# Altium project TIMESTICK_2.1.PrjPcb
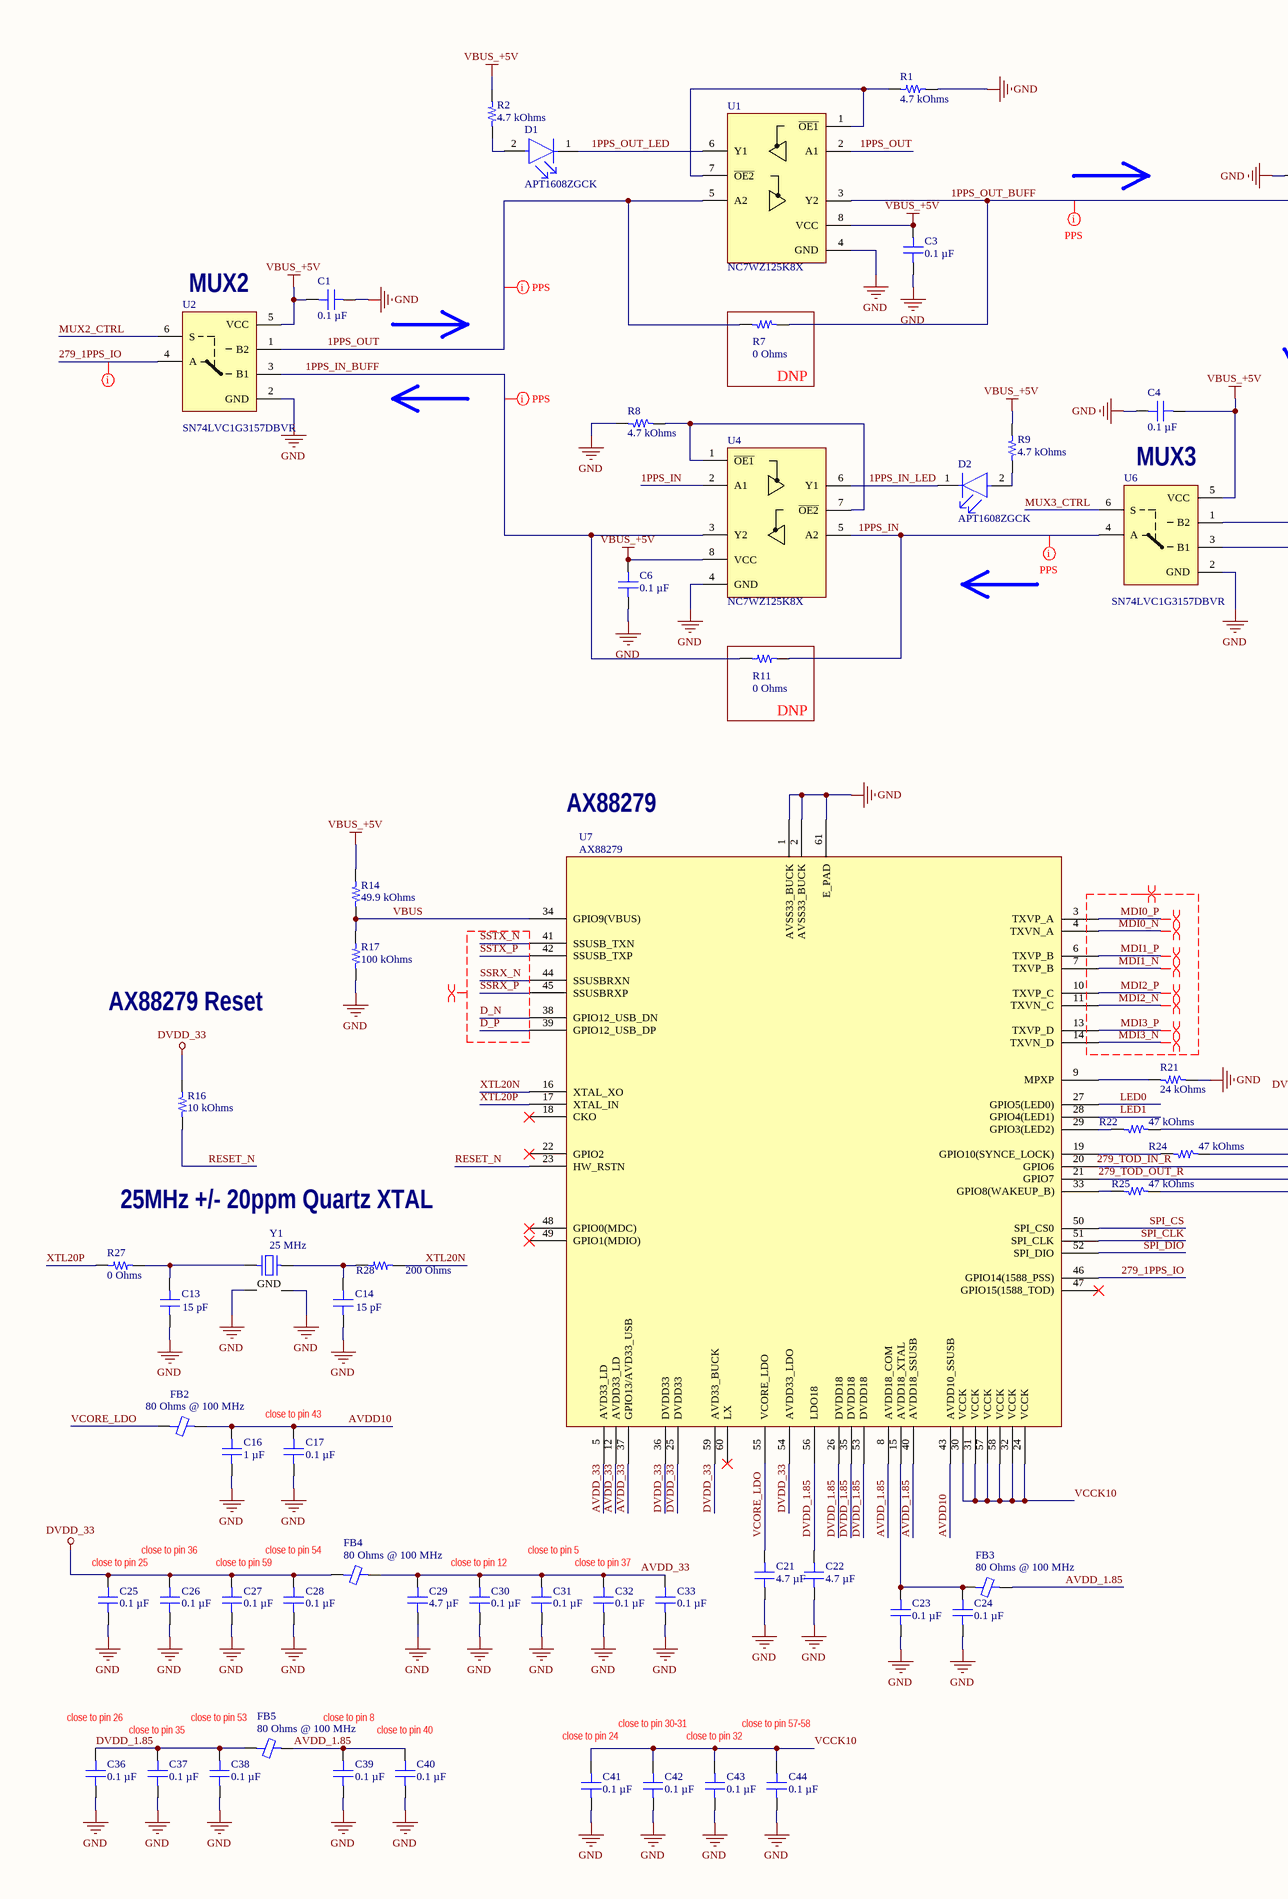
[diagram p0: MAIN.SchDoc, left]
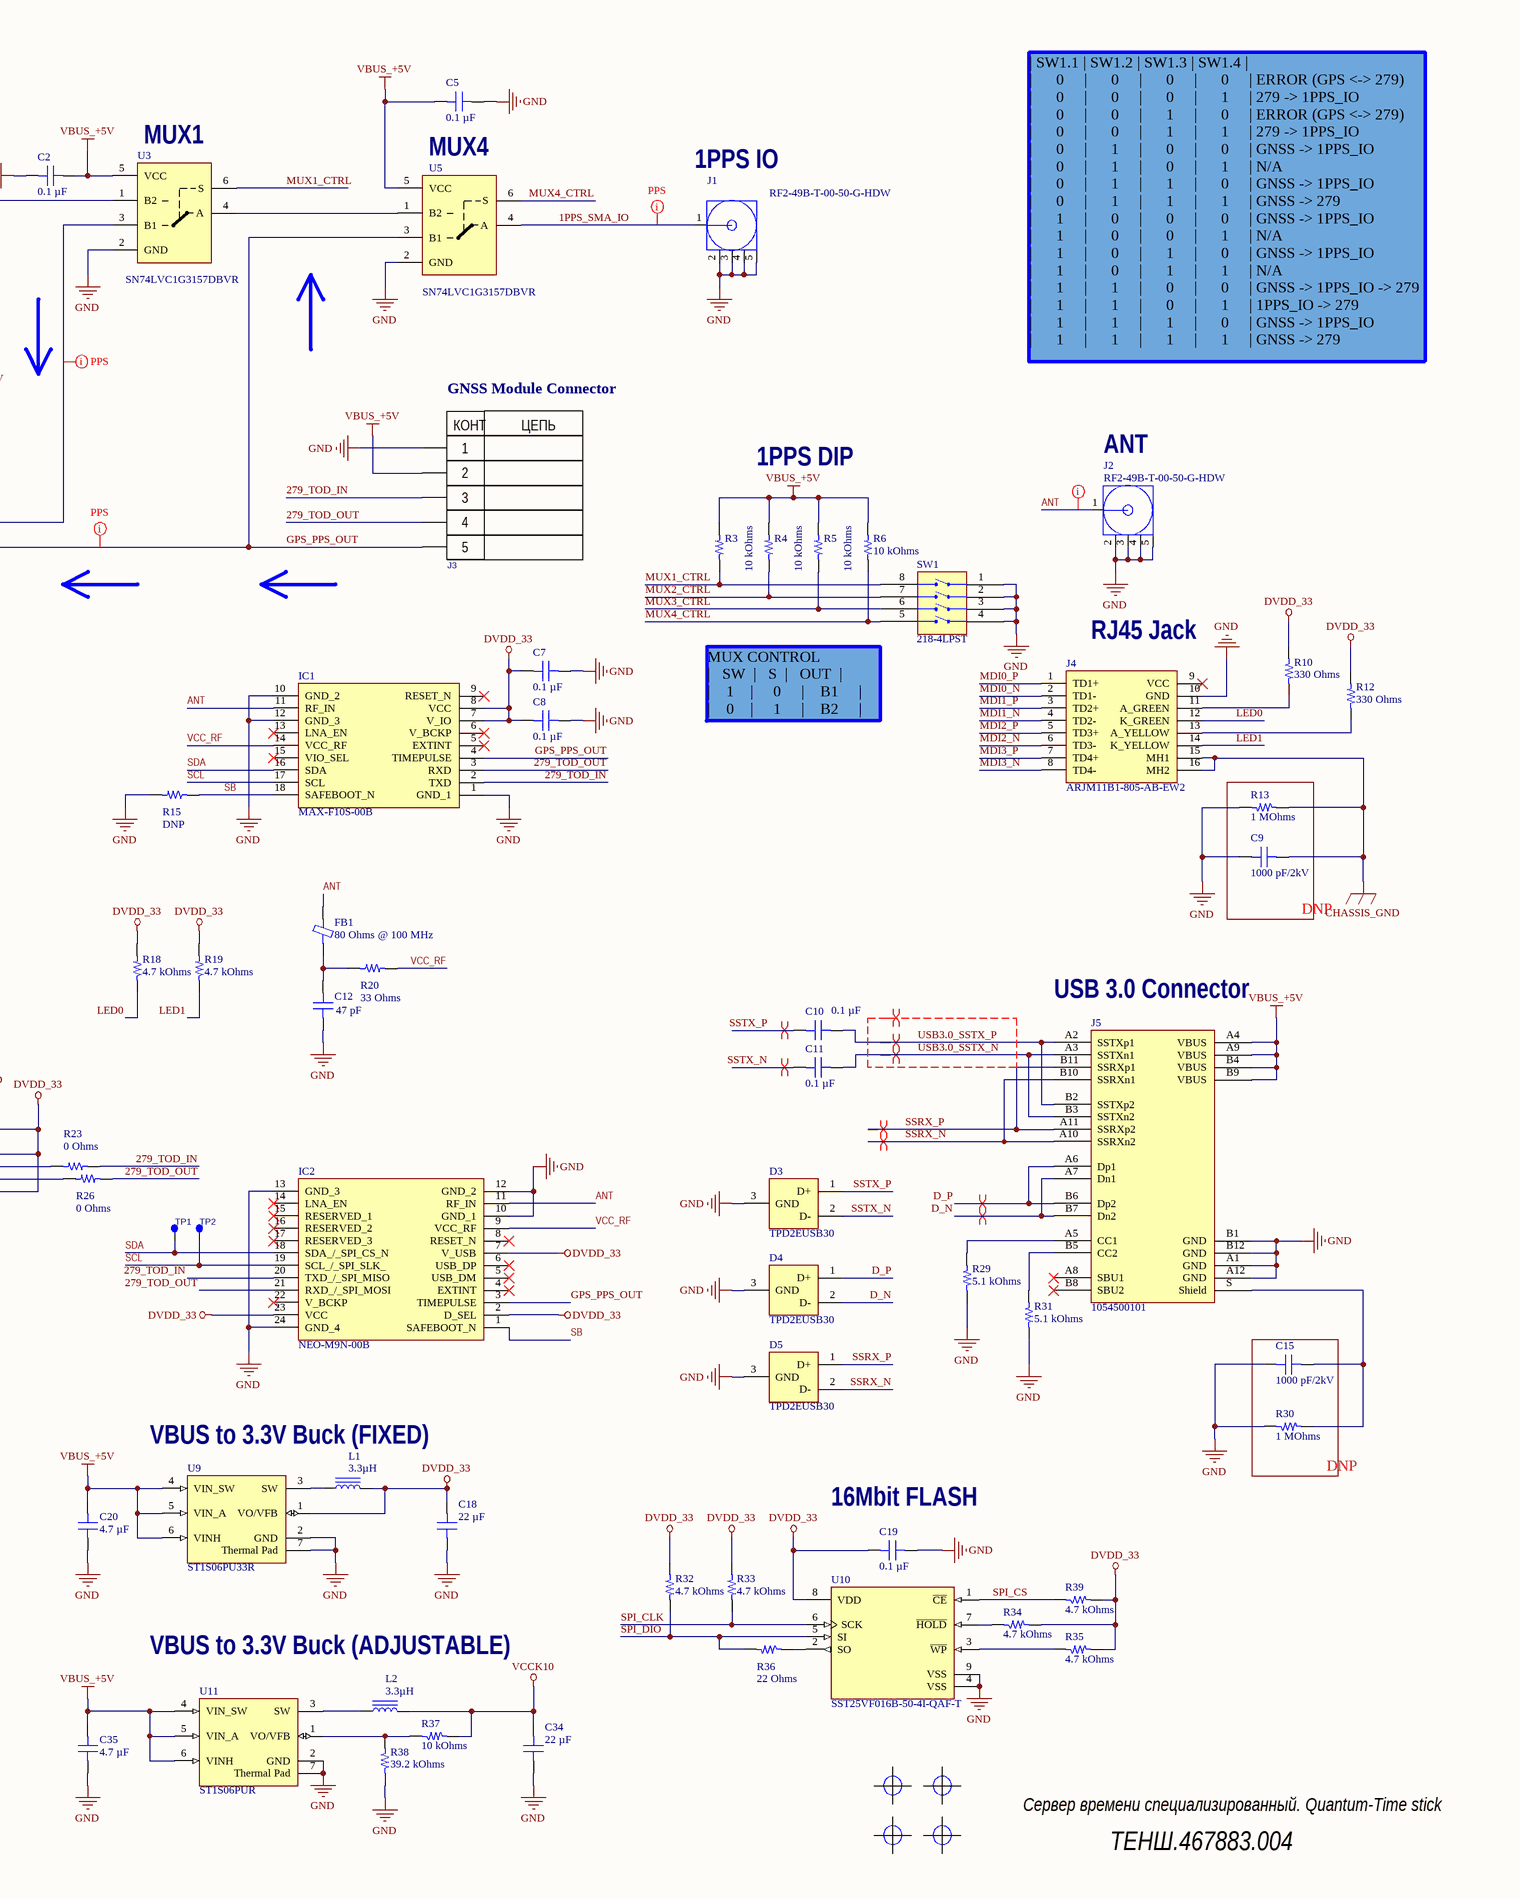
[diagram p1: MAIN.SchDoc, right]
revision: rev.1.2
1 sheet, 120 parts. Net scope: global (net labels, ports and power ports of the same name join across sheets).
Board file: TIMESTICK_2.1.PcbDoc

## Sheet MAIN.SchDoc
size A2; SheetNumber: 1; SheetTotal: 1

### Parts
C1  0.1 µF  [CAP 0402_1005]
C2  0.1 µF  [CAP 0402_1005]
C3  0.1 µF  [CAP 0402_1005]
C4  0.1 µF  [CAP 0402_1005]
C5  0.1 µF  [CAP 0402_1005]
C6  0.1 µF  [CAP 0402_1005]
C7  0.1 µF  [CAP 0402_1005]
C8  0.1 µF  [CAP 0402_1005]
C9  1000 pF/2kV  [CAP 1206_3216 - 0.8MM]
C10  0.1 µF  [CAP 0402_1005]
C11  0.1 µF  [CAP 0402_1005]
C12  47 pF  [CAP 0402_1005]
C13  15 pF  [CAP 0402_1005]
C14  15 pF  [CAP 0402_1005]
C15  1000 pF/2kV  [CAP 1206_3216 - 0.8MM]
C16  1 µF  [CAP 0402_1005]
C17  0.1 µF  [CAP 0402_1005]
C18  22 µF  [CAP 0603_1608]
C19  0.1 µF  [CAP 0402_1005]
C20  4.7 µF  [CAP 0402_1005]
C21  4.7 µF  [CAP 0402_1005]
C22  4.7 µF  [CAP 0402_1005]
C23  0.1 µF  [CAP 0402_1005]
C24  0.1 µF  [CAP 0402_1005]
C25  0.1 µF  [CAP 0402_1005]
C26  0.1 µF  [CAP 0402_1005]
C27  0.1 µF  [CAP 0402_1005]
C28  0.1 µF  [CAP 0402_1005]
C29  4.7 µF  [CAP 0402_1005]
C30  0.1 µF  [CAP 0402_1005]
C31  0.1 µF  [CAP 0402_1005]
C32  0.1 µF  [CAP 0402_1005]
C33  0.1 µF  [CAP 0402_1005]
C34  22 µF  [CAP 0603_1608]
C35  4.7 µF  [CAP 0402_1005]
C36  0.1 µF  [CAP 0402_1005]
C37  0.1 µF  [CAP 0402_1005]
C38  0.1 µF  [CAP 0402_1005]
C39  0.1 µF  [CAP 0402_1005]
C40  0.1 µF  [CAP 0402_1005]
C41  0.1 µF  [CAP 0402_1005]
C42  0.1 µF  [CAP 0402_1005]
C43  0.1 µF  [CAP 0402_1005]
C44  0.1 µF  [CAP 0402_1005]
D1  APT1608ZGCK  [FP-APT1608ZGCK-MFG]
D2  APT1608ZGCK  [FP-APT1608ZGCK-MFG]
D3  TPD2EUSB30  [SOT35P100X50-3N]
D4  TPD2EUSB30  [SOT35P100X50-3N]
D5  TPD2EUSB30  [SOT35P100X50-3N]
FB1  80 Ohms @ 100 MHz  [FER 0402_1005]
FB2  80 Ohms @ 100 MHz  [FER 0402_1005]
FB3  80 Ohms @ 100 MHz  [FER 0402_1005]
FB4  80 Ohms @ 100 MHz  [FER 0402_1005]
FB5  80 Ohms @ 100 MHz  [FER 0402_1005]
IC1  MAX-F10S-00B  [MAXF10S00B]
IC2  NEO-M9N-00B  [NEOM9N00B]
J1  RF2-49B-T-00-50-G-HDW  [RF249BT0050GHDW]
J2  RF2-49B-T-00-50-G-HDW  [RF249BT0050GHDW]
J3  PBS-5  [PBS-5]  (value not drawn)
J4  ARJM11B1-805-AB-EW2  [ARJM11B1805ABEW2]
J5  1054500101  [Molex 1054500101]
L1  3.3µH  [IND 1008_2520]
L2  3.3µH  [IND 1008_2520]
MNT1  MOUNT_HOLE  [MOUNT_3mm]  (value not drawn)  (no BOM)
MNT2  MOUNT_HOLE  [MOUNT_3mm]  (value not drawn)  (no BOM)
MNT3  MOUNT_HOLE  [MOUNT_3mm]  (value not drawn)  (no BOM)
MNT4  MOUNT_HOLE  [MOUNT_3mm]  (value not drawn)  (no BOM)
R1  4.7 kOhms  [YAGEO RES 0402_1005]
R2  4.7 kOhms  [YAGEO RES 0402_1005]
R3  10 kOhms  [YAGEO RES 0402_1005]
R4  10 kOhms  [YAGEO RES 0402_1005]
R5  10 kOhms  [YAGEO RES 0402_1005]
R6  10 kOhms  [YAGEO RES 0402_1005]
R7  0 Ohms  [YAGEO RES 0402_1005]
R8  4.7 kOhms  [YAGEO RES 0402_1005]
R9  4.7 kOhms  [YAGEO RES 0402_1005]
R10  330 Ohms  [YAGEO RES 0402_1005]
R11  0 Ohms  [YAGEO RES 0402_1005]
R12  330 Ohms  [YAGEO RES 0402_1005]
R13  1 MOhms  [YAGEO RES 0402_1005]
R14  49.9 kOhms  [YAGEO RES 0402_1005]
R15  DNP  [YAGEO RES 0402_1005]
R16  10 kOhms  [YAGEO RES 0402_1005]
R17  100 kOhms  [YAGEO RES 0402_1005]
R18  4.7 kOhms  [YAGEO RES 0402_1005]
R19  4.7 kOhms  [YAGEO RES 0402_1005]
R20  33 Ohms  [YAGEO RES 0402_1005]
R21  24 kOhms  [YAGEO RES 0402_1005]
R22  47 kOhms  [YAGEO RES 0402_1005]
R23  0 Ohms  [YAGEO RES 0402_1005]
R24  47 kOhms  [YAGEO RES 0402_1005]
R25  47 kOhms  [YAGEO RES 0402_1005]
R26  0 Ohms  [YAGEO RES 0402_1005]
R27  0 Ohms  [YAGEO RES 0402_1005]
R28  200 Ohms  [YAGEO RES 0402_1005]
R29  5.1 kOhms  [YAGEO RES 0402_1005]
R30  1 MOhms  [YAGEO RES 0402_1005]
R31  5.1 kOhms  [YAGEO RES 0402_1005]
R32  4.7 kOhms  [YAGEO RES 0402_1005]
R33  4.7 kOhms  [YAGEO RES 0402_1005]
R34  4.7 kOhms  [YAGEO RES 0402_1005]
R35  4.7 kOhms  [YAGEO RES 0402_1005]
R36  22 Ohms  [YAGEO RES 0402_1005]
R37  10 kOhms  [YAGEO RES 0402_1005]
R38  39.2 kOhms  [YAGEO RES 0402_1005]
R39  4.7 kOhms  [YAGEO RES 0402_1005]
SW1  218-4LPST  [CTS 218-4LPJ]
TP1  PAD_TEST  [PAD_TEST]  (value not drawn)  (no BOM)
TP2  PAD_TEST  [PAD_TEST]  (value not drawn)  (no BOM)
U1  NC7WZ125K8X  [SOP50P310X90-8N]
U2  SN74LVC1G3157DBVR  [SOT95P280X145-6N]
U3  SN74LVC1G3157DBVR  [SOT95P280X145-6N]
U4  NC7WZ125K8X  [SOP50P310X90-8N]
U5  SN74LVC1G3157DBVR  [SOT95P280X145-6N]
U6  SN74LVC1G3157DBVR  [SOT95P280X145-6N]
U7  AX88279  [IC_AX88279]
U9  ST1S06PU33R  [DFN6D_L]
U10  SST25VF016B-50-4I-QAF-T  [FP-C04-452-MFG]
U11  ST1S06PUR  [DFN6D_M]
Y1  25 MHz  [NDK NX3225GA]

### Blocks framed on the sheet
DNP: R7
DNP: R11
DNP: C9 R13
DNP: C15 R30

### Nets
CHASSIS_GND: C9.1 J4.15(MH1) J4.16(MH2) R13.1
DVDD_33: C7.2 C8.2 C18.2 C19.2 C25.2 C26.2 C27.2 C28.2 FB4.1 IC1.7(V_IO) IC1.8(VCC) IC2.2(D_SEL) IC2.7(V_USB) IC2.23(VCC) L1.2 R10.2 R12.2 R16.2 R18.1 R19.1 R22.2 R24.2 R25.2 R32.1 R33.1 R34.1 R35.1 R39.1 U7.25(DVDD33) U7.36(DVDD33) U7.54(AVDD33_LDO) U7.59(AVD33_BUCK) U9.1(VO/VFB) U10.8(VDD)
GND: C1.1 C2.1 C3.1 C4.1 C5.1 C6.1 C7.1 C8.1 C9.2 C12.1 C13.1 C14.1 C15.1 C16.1 C17.1 C18.1 C19.1 C20.1 C21.1 C22.1 C23.1 C24.1 C25.1 C26.1 C27.1 C28.1 C29.1 C30.1 C31.1 C32.1 C33.1 C34.1 C35.1 C36.1 C37.1 C38.1 C39.1 C40.1 C41.1 C42.1 C43.1 C44.1 D3.3(GND) D4.3(GND) D5.3(GND) IC1.1(GND_1) IC1.10(GND_2) IC1.12(GND_3) IC2.10(GND_1) IC2.12(GND_2) IC2.13(GND_3) IC2.24(GND_4) J1.2 J1.3 J1.4 J1.5 J2.2 J2.3 J2.4 J2.5 J3.1 J4.10(GND) J5.A1(GND) J5.A12(GND) J5.B1(GND) J5.B12(GND) R1.2 R8.1 R13.2 R15.2 R17.1 R21.1 R29.2 R30.1 R31.2 R38.2 SW1.1(GND) SW1.2(GND) SW1.3(GND) SW1.4(GND) U1.4(GND) U2.2(GND) U3.2(GND) U4.4(GND) U5.2(GND) U6.2(GND) U7.1(AVSS33_BUCK) U7.2(AVSS33_BUCK) U7.61(E_PAD) U9.2(GND) U9.7(Thermal_Pad) U10.4(VSS) U10.9(VSS) U11.2(GND) U11.7(Thermal_Pad) Y1.2(GND) Y1.4(GND)
VBUS_+5V: C1.2 C2.2 C3.2 C4.2 C5.2 C6.2 C20.2 C35.2 J3.2 J5.A4(VBUS) J5.A9(VBUS) J5.B4(VBUS) J5.B9(VBUS) R2.2 R3.2 R4.2 R5.2 R6.2 R9.2 R14.2 U1.8(VCC) U2.5(VCC) U3.5(VCC) U4.8(VCC) U5.5(VCC) U6.5(VCC) U9.4(VIN_SW) U9.5(VIN_A) U9.6(VINH) U11.4(VIN_SW) U11.5(VIN_A) U11.6(VINH)
VCCK10: C34.2 C41.2 C42.2 C43.2 C44.2 L2.2 R37.1 U7.24(VCCK) U7.30(VCCK) U7.31(VCCK) U7.32(VCCK) U7.57(VCCK) U7.58(VCCK)
1PPS_IN: R11.1 U4.2(A1) U4.5(A2) U6.4(A)
1PPS_IN_BUFF: R11.2 U2.3(B1) U4.3(Y2)
1PPS_IN_LED: D2.1(C) U4.6(Y1)
1PPS_OUT: R7.2 U1.2(A1) U1.5(A2) U2.1(B2)
1PPS_OUT_BUFF: R7.1 U1.3(Y2) U3.1(B2)
1PPS_OUT_LED: D1.1(C) U1.6(Y1)
1PPS_SMA_IO: J1.1 U5.4(A)
279_1PPS_IO: U2.4(A) U7.46(GPIO14(1588_PSS))
279_TOD_IN: IC1.2(TXD) IC2.20(TXD_/_SPI_MISO) J3.3 R23.1
279_TOD_IN_R: R23.2 U7.20(GPIO6)
279_TOD_OUT: IC1.3(RXD) IC2.21(RXD_/_SPI_MOSI) J3.4 R26.1
279_TOD_OUT_R: R26.2 U7.21(GPIO7)
ANT: FB1.2 IC1.11(RF_IN) IC2.11(RF_IN) J2.1
AVDD10: C16.2 C17.2 FB2.2 U7.43(AVDD10_SSUSB)
AVDD_1.85: C39.2 C40.2 FB3.2 FB5.2 U7.8(AVDD18_COM) U7.40(AVDD18_SSUSB)
AVDD_33: C29.2 C30.2 C31.2 C32.2 C33.2 FB4.2 U7.5(AVD33_LD) U7.12(AVDD33_LD) U7.37(GPIO13/AVD33_USB)
D_N: D4.2(D-) J5.A7(Dn1) J5.B7(Dn2) U7.38(GPIO12_USB_DN)
D_P: D4.1(D+) J5.A6(Dp1) J5.B6(Dp2) U7.39(GPIO12_USB_DP)
DVDD_1.85: C22.2 C36.2 C37.2 C38.2 FB5.1 U7.26(DVDD18) U7.35(DVDD18) U7.53(DVDD18) U7.56(LDO18)
GPS_PPS_OUT: IC1.4(TIMEPULSE) IC2.3(TIMEPULSE) J3.5 U5.3(B1) U6.3(B1)
LED0: J4.12(K_GREEN) R18.2 U7.27(GPIO5(LED0))
LED1: J4.14(K_YELLOW) R19.2 U7.28(GPIO4(LED1))
MDI0_N: J4.2(TD1-) U7.4(TXVN_A)
MDI0_P: J4.1(TD1+) U7.3(TXVP_A)
MDI1_N: J4.4(TD2-) U7.7(TXVP_B)
MDI1_P: J4.3(TD2+) U7.6(TXVP_B)
MDI2_N: J4.6(TD3-) U7.11(TXVN_C)
MDI2_P: J4.5(TD3+) U7.10(TXVP_C)
MDI3_N: J4.8(TD4-) U7.14(TXVN_D)
MDI3_P: J4.7(TD4+) U7.13(TXVP_D)
MUX1_CTRL: R3.1 SW1.8 U3.6(S)
MUX2_CTRL: R4.1 SW1.7 U2.6(S)
MUX3_CTRL: R5.1 SW1.6 U6.6(S)
MUX4_CTRL: R6.1 SW1.5 U5.6(S)
RESET_N: R16.1 U7.23(HW_RSTN)
SB: IC1.18(SAFEBOOT_N) IC2.1(SAFEBOOT_N) R15.1
SCL: IC1.17(SCL) IC2.19(SCL_/_SPI_SLK_) TP2.1
SDA: IC1.16(SDA) IC2.18(SDA_/_SPI_CS_N) TP1.1
SPI_CLK: R33.2 U7.51(SPI_CLK) U10.6(SCK)
SPI_CS: R39.2 U7.50(SPI_CS0) U10.1(~{CE})
SPI_DIO: R32.2 R36.2 U7.52(SPI_DIO) U10.5(SI)
SSRX_N: D5.2(D-) J5.A10(SSRXn2) J5.B10(SSRXn1) U7.44(SSUSBRXN)
SSRX_P: D5.1(D+) J5.A11(SSRXp2) J5.B11(SSRXp1) U7.45(SSUSBRXP)
SSTX_N: C11.2 D3.2(D-) U7.41(SSUSB_TXN)
SSTX_P: C10.2 D3.1(D+) U7.42(SSUSB_TXP)
USB3.0_SSTX_N: C11.1 J5.A3(SSTXn1) J5.B3(SSTXn2)
USB3.0_SSTX_P: C10.1 J5.A2(SSTXp1) J5.B2(SSTXp2)
VBUS: R14.1 R17.2 U7.34(GPIO9(VBUS))
VCC_RF: IC1.14(VCC_RF) IC2.9(VCC_RF) R20.1
VCORE_LDO: C21.2 FB2.1 U7.55(VCORE_LDO)
XTL20N: R28.2 U7.16(XTAL_XO)
XTL20P: R27.2 U7.17(XTAL_IN)
NetC12_2: C12.2 FB1.1 R20.2
NetC13_2: C13.2 R27.1 Y1.1
NetC14_2: C14.2 R28.1 Y1.3
NetC15_2: C15.2 J5.S(Shield) R30.2
NetC23_2: C23.2 C24.2 FB3.1 U7.15(AVDD18_XTAL)
NetD1_2: D1.2(A) R2.1
NetD2_2: D2.2(A) R9.1
NetJ4_11: J4.11(A_GREEN) R10.1
NetJ4_13: J4.13(A_YELLOW) R12.1
NetJ5_A5: J5.A5(CC1) R29.1
NetJ5_B5: J5.B5(CC2) R31.1
NetL1_1: L1.1 U9.3(SW)
NetL2_1: L2.1 U11.3(SW)
NetR1_1: R1.1 U1.1(~{OE1}) U1.7(~{OE2})
NetR8_2: R8.2 U4.1(~{OE1}) U4.7(~{OE2})
NetR21_2: R21.2 U7.9(MPXP)
NetR22_1: R22.1 U7.29(GPIO3(LED2))
NetR24_1: R24.1 U7.19(GPIO10(SYNCE_LOCK))
NetR25_1: R25.1 U7.33(GPIO8(WAKEUP_B))
NetR34_2: R34.2 U10.7(~{HOLD})
NetR35_2: R35.2 U10.3(~{WP})
NetR36_1: R36.1 U10.2(SO)
NetR37_2: R37.2 R38.1 U11.1(VO/VFB)
NetU3_3: U3.3(B1) U6.1(B2)
NetU3_4: U3.4(A) U5.1(B2)

Not connected (* = marked no-connect by the designer): IC1 5(EXTINT)* 6(V_BCKP)* 9(RESET_N)* 13(LNA_EN)* 15(VIO_SEL)*; IC2 4(EXTINT)* 5(USB_DM)* 6(USB_DP)* 8(RESET_N)* 14(LNA_EN)* 15(RESERVED_1)* 16(RESERVED_2)* 17(RESERVED_3)* 22(V_BCKP)*; J4 9(VCC)*; J5 A8(SBU1)* B8(SBU2)*; U7 18(CKO)* 22(GPIO2)* 47(GPIO15(1588_TOD))* 48(GPIO0(MDC))* 49(GPIO1(MDIO))* 60(LX)*

### Layout directives
differential pair; differential pair class MDI: MDI0_N, MDI0_P, MDI1_N, MDI1_P, MDI2_N, MDI2_P, MDI3_N, MDI3_P
differential pair; differential pair class USB; differential pair class *: D_N
differential pair; differential pair class USB: D_P, SSRX_N, SSRX_P, SSTX_N, SSTX_P, USB3.0_SSTX_N, USB3.0_SSTX_P
net class PPS_50: 1PPS_IN, 1PPS_IN_BUFF, 1PPS_OUT, 1PPS_OUT_BUFF, 1PPS_SMA_IO, 279_1PPS_IO, ANT, GPS_PPS_OUT, NetU3_3
differential pair; differential pair class D100; net class MDI: MDI0_N, MDI0_P, MDI1_N, MDI1_P, MDI2_N, MDI2_P, MDI3_N, MDI3_P
differential pair; differential pair class D90; net class USB: D_N, D_P, SSRX_N, SSRX_P, SSTX_N, SSTX_P, USB3.0_SSTX_N, USB3.0_SSTX_P

### Notes on the sheet
- (near U3) MUX1
- MUX4
- 1PPS IO
- (near U2) MUX2
- GNSS Module Connector
- | SW1.1 | SW1.2 | SW1.3 | SW1.4 |
  |      0     |      0     |      0     |      0     | ERROR (GPS <-> 279)
  |      0     |      0     |      0     |      1     | 279 -> 1PPS_IO
  |      0     |      0     |      1     |      0     | ERROR (GPS <-> 279)
  |      0     |      0     |      1     |      1     | 279 -> 1PPS_IO
  |      0     |      1     |      0     |      0     | GNSS -> 1PPS_IO
  |      0     |      1     |      0     |      1     | N/A
  |      0     |      1     |      1     |      0     | GNSS -> 1PPS_IO
  |      0     |      1     |      1     |      1     | GNSS -> 279
  |      1     |      0     |      0     |      0     | GNSS -> 1PPS_IO
  |      1     |      0     |      0     |      1     | N/A
  |      1     |      0     |      1     |      0     | GNSS -> 1PPS_IO
  |      1     |      0     |      1     |      1     | N/A
  |      1     |      1     |      0     |      0     | GNSS -> 1PPS_IO -> 279
  |      1     |      1     |      0     |      1     | 1PPS_IO -> 279
  |      1     |      1     |      1     |      0     | GNSS -> 1PPS_IO
  |      1     |      1     |      1     |      1     | GNSS -> 279
- ANT
- MUX3
- 1PPS DIP
- (near J4) RJ45 Jack
- (near SW1) MUX CONTROL
  |   SW  |   S  |   OUT  |
  |    1    |     0     |    B1     |
  |    0    |     1     |    B2     |
- (near U7) AX88279
- AX88279 Reset
- (near J5) USB 3.0 Connector
- 25MHz +/- 20ppm Quartz XTAL
- close to pin 43
- VBUS to 3.3V Buck (FIXED)
- (near C19) 16Mbit FLASH
- close to pin 25
- close to pin 36
- close to pin 59
- close to pin 54
- close to pin 12
- close to pin 5
- close to pin 37
- VBUS to 3.3V Buck (ADJUSTABLE)
- close to pin 26
- close to pin 35
- close to pin 53
- close to pin 8
- close to pin 40
- close to pin 24
- close to pin 30-31
- close to pin 32
- close to pin 57-58
- Сервер времени специализированный. Quantum-Time stick
- ТЕНШ.467883.004
- (in symbol PBS-5) КОНТ; ЦЕПЬ

### Library data of the parts
C1-C8 C10 C11 C17 C19 C23-C28 C30-C33 C36-C44 = CC0402KRX7R6BB104: CAP CER 0.1UF 10V X7R 0402; manufacturer: Yageo; Tolerance: ±10%; packaging: CutTape; Capacitance: 0.1 µF; Value: 0.1 µF; series: CC; Part Number: CC0402KRX7R6BB104; Applications: General Purpose; componentlink1description: Datasheet; componentlink1url: https://www.yageo.com/upload/media/product/productsearch/datasheet/mlcc/UPY-GPHC_X7R_6.3V-to-50V_18.pdf; componentlink2description: DigiKey Link; componentlink2url: https://www.digikey.com/en/products/detail/yageo/CC0402KRX7R6BB104/2103083; Device Package: 0402 (1005 Metric); lastupdated: 09.02.2024 20:04:34; Lifecycle Status: Active; Minimum Order: 10; Mounting Type: Surface Mount, MLCC; Operating Temperature: -55°C ~ 125°C; Package / Case: 0402 (1005 Metric); partid: 3877; Part Status: Active; price: 0.01; Size / Dimension: 0.039" L x 0.020" W (1.00mm x 0.50mm); Supplier 1: DigiKey; Supplier Part Number 1: 311-1345-1-ND; Temperature Coefficient: X7R; Thickness (Max): 0.022" (0.55mm); Voltage - Rated: 10V
C9 C15 = CC1206KKX7RDBB102: CAP CER 1000PF 2KV X7R 1206; manufacturer: Yageo; Tolerance: ±10%; Voltage - Rated: 2000V (2kV); Part Number: CC1206KKX7RDBB102; Value: 1000 pF/2kV; Applications: General Purpose; Capacitance: 1000 pF; componentlink1description: Datasheet; componentlink1url: https://www.yageo.com/upload/media/product/productsearch/datasheet/mlcc/UPY-NP0X7R_HV_1KV-to-3KV_11.pdf; componentlink2description: DigiKey Link; componentlink2url: https://www.digikey.com/en/products/detail/yageo/CC1206KKX7RDBB102/2833652; Device Package: 1206 (3216 Metric); Features: High Voltage; lastupdated: 04.06.2024 19:10:41; Lifecycle Status: Active; Minimum Order: 1; Mounting Type: Surface Mount, MLCC; Operating Temperature: -55°C ~ 125°C; Package / Case: 1206 (3216 Metric); packaging: TapeAndReel; partid: 19484; Part Status: Active; price: 0.06; series: CC; Size / Dimension: 0.126" L x 0.063" W (3.20mm x 1.60mm); Supplier 1: DigiKey; Supplier Part Number 1: 311-1487-1-ND; Temperature Coefficient: X7R; Thickness (Max): 0.057" (1.45mm)
C12 = CC0402KRNPO9BN470: CAP CER 47PF 50V C0G/NPO 0402; manufacturer: Yageo; Tolerance: ±10%; Temperature Coefficient: C0G, NP0; Value: 47 pF; Capacitance: 47 pF; componentlink2description: DigiKey Link; componentlink2url: https://www.digikey.com/en/products/detail/yageo/CC0402KRNPO9BN470/5883324; Part Number: CC0402KRNPO9BN470; Applications: General Purpose; componentlink1description: Datasheet; componentlink1url: https://www.yageo.com/upload/media/product/productsearch/datasheet/mlcc/UPY-GP_NP0_16V-to-50V_17.pdf; Device Package: 0402 (1005 Metric); lastupdated: 09.02.2024 20:04:34; Lifecycle Status: Active; Minimum Order: 10; Mounting Type: Surface Mount, MLCC; Operating Temperature: -55°C ~ 125°C; Package / Case: 0402 (1005 Metric); packaging: CutTape; partid: 3939; Part Status: Active; price: 0.01; series: CC; Size / Dimension: 0.039" L x 0.020" W (1.00mm x 0.50mm); Supplier 1: DigiKey; Supplier Part Number 1: 311-3783-1-ND; Thickness (Max): 0.022" (0.55mm); Voltage - Rated: 50V
C13 C14 = CC0402KRNPO9BN150: CAP CER 15PF 50V C0G/NPO 0402; manufacturer: Yageo; Tolerance: ±10%; Temperature Coefficient: C0G, NP0; Value: 15 pF; Capacitance: 15 pF; componentlink2description: DigiKey Link; componentlink2url: https://www.digikey.com/en/products/detail/yageo/CC0402KRNPO9BN150/5883321; Part Number: CC0402KRNPO9BN150; Applications: General Purpose; componentlink1description: Datasheet; componentlink1url: https://www.yageo.com/upload/media/product/productsearch/datasheet/mlcc/UPY-GP_NP0_16V-to-50V_17.pdf; Device Package: 0402 (1005 Metric); lastupdated: 09.02.2024 20:04:34; Lifecycle Status: Active; Minimum Order: 10; Mounting Type: Surface Mount, MLCC; Operating Temperature: -55°C ~ 125°C; Package / Case: 0402 (1005 Metric); packaging: CutTape; partid: 3947; Part Status: Active; price: 0.01; series: CC; Size / Dimension: 0.039" L x 0.020" W (1.00mm x 0.50mm); Supplier 1: DigiKey; Supplier Part Number 1: 311-3780-1-ND; Thickness (Max): 0.022" (0.55mm); Voltage - Rated: 50V
C16 = CC0402KRX5R6BB105: CAP CER 1UF 10V X5R 0402; manufacturer: Yageo; Tolerance: ±10%; packaging: TapeAndReel; Capacitance: 1 µF; Value: 1 µF; series: CC; Part Number: CC0402KRX5R6BB105; Applications: General Purpose; componentlink1description: Datasheet; componentlink1url: https://www.yageo.com/upload/media/product/productsearch/datasheet/mlcc/UPY-GPHC_X5R_4V-to-50V_25.pdf; componentlink2description: DigiKey Link; componentlink2url: https://www.digikey.com/en/products/detail/yageo/CC0402KRX5R6BB105/2833604; Device Package: 0402 (1005 Metric); lastupdated: 09.02.2024 20:04:31; Lifecycle Status: Active; Minimum Order: 1; Mounting Type: Surface Mount, MLCC; Operating Temperature: -55°C ~ 85°C; Package / Case: 0402 (1005 Metric); partid: 44232; Part Status: Active; price: 0.01; Size / Dimension: 0.039" L x 0.020" W (1.00mm x 0.50mm); Supplier 1: DigiKey; Supplier Part Number 1: 311-1439-1-ND; Temperature Coefficient: X5R; Thickness (Max): 0.022" (0.55mm); Voltage - Rated: 10V
C18 C34 = CC0603MRX5R6BB226: CAP CER 22UF 10V X5R 0603; manufacturer: Yageo; Tolerance: ±20%; packaging: TapeAndReel; Package / Case: 0603 (1608 Metric); Voltage - Rated: 10V; Operating Temperature: -55°C ~ 85°C; Applications: General Purpose; Mounting Type: Surface Mount, MLCC; Size / Dimension: 0.063" L x 0.031" W (1.60mm x 0.80mm); Capacitance: 22 µF; series: CC; Thickness (Max): 0.035" (0.90mm); Temperature Coefficient: X5R; Value: 22 µF; componentlink1url: https://www.yageo.com/upload/media/product/productsearch/datasheet/mlcc/UPY-GPHC_X5R_4V-to-50V_26.pdf; componentlink1description: Datasheet; componentlink2url: https://www.digikey.com/en/products/detail/yageo/CC0603MRX5R6BB226/5195226; componentlink2description: DigiKey Link; Part Number: CC0603MRX5R6BB226; Device Package: 0603 (1608 Metric); lastupdated: 09.02.2024 20:09:50; Lifecycle Status: Active; Minimum Order: 1; partid: 45305; Part Status: Active; price: 0.16; Supplier 1: DigiKey; Supplier Part Number 1: 311-1819-1-ND
C20-C22 C29 C35 = CC0402MRX5R6BB475: CAP CER 4.7UF 10V X5R 0402; manufacturer: Yageo; Tolerance: ±20%; packaging: TapeAndReel; Capacitance: 4.7 µF; Value: 4.7 µF; series: CC; componentlink1url: https://www.yageo.com/upload/media/product/productsearch/datasheet/mlcc/UPY-GPHC_X5R_4V-to-50V_25.pdf; componentlink1description: Datasheet; componentlink2url: https://www.digikey.com/en/products/detail/yageo/CC0402MRX5R6BB475/5195143; componentlink2description: DigiKey Link; Part Number: CC0402MRX5R6BB475; Applications: General Purpose; Device Package: 0402 (1005 Metric); lastupdated: 09.02.2024 20:04:16; Lifecycle Status: Active; Minimum Order: 1; Mounting Type: Surface Mount, MLCC; Operating Temperature: -55°C ~ 85°C; Package / Case: 0402 (1005 Metric); partid: 27083; Part Status: Active; price: 0.01; Size / Dimension: 0.039" L x 0.020" W (1.00mm x 0.50mm); Supplier 1: DigiKey; Supplier Part Number 1: 311-1734-1-ND; Temperature Coefficient: X5R; Thickness (Max): 0.026" (0.65mm); Voltage - Rated: 10V
D1 D2 = CMP-44529-000024-1: LED GREEN CLEAR CHIP SMD; Manufacturer: Kingbright; Forward Voltage: 3.3V; Dominant Wavelength: 525nm; Forward Current: 20mA; Lens Color: Colorless; Viewing Angle: 120°; Luminous Intensity: 350mcd; Lens Transparency: Clear; Color: Green; Max Operating Temperature: 85°C; Case/Package: 0603; Mount: Surface Mount; Min Operating Temperature: -40°C; Case Code (Metric): 1608; Test Current: 20mA; Packaging: Tape and Reel; Width: 0.8mm; Package Quantity: 1; Height: 0.75mm; Length: 1.6mm; Illumination Color: Green; Lead Free: Lead Free; Case Code (Imperial): 0603; Supplier: LCSC; Supplier Part Number: C5554158; Manufacturer Part Number: APT1608ZGCK; RoHS: Yes; Category: LEDs; Stock: 1770; Pricing: 5=0.3043, 50=0.2442, 150=0.2184, 500=0.1863, 2000=0.1719, 4000=0.1633 (USD); Mounting Technology: Surface Mount; Series: HELI2; RoHS Compliant: Yes; ComponentLink1URL: https://datasheet.ciiva.com/16422/apt1608zgck-262051-16422477.pdf?src-supplier=Mouser; ComponentLink1Description: https://datasheet.ciiva.com/16422/apt1608zgck-262051-16422477.pdf?src-supplier=Mouser; ComponentLink2URL: https://datasheet.ciiva.com/26292/apt1608zgck-26292289.pdf?src-supplier=Digikey; ComponentLink2Description: https://datasheet.ciiva.com/26292/apt1608zgck-26292289.pdf?src-supplier=Digikey; ComponentLink3URL: https://datasheet.ciiva.com/29562/apt1608zgck-29562277.pdf?src-supplier=Digikey; ComponentLink3Description: https://datasheet.ciiva.com/29562/apt1608zgck-29562277.pdf?src-supplier=Digikey
D3-D5 = TPD2EUSB30ADRTR: TVS DIODE 3.6VWM 8VC SOT3; Manufacturer_Name: Texas Instruments; Datasheet Link: http://www.ti.com/lit/gpn/tpd2eusb30a; Manufacturer_Part_Number: TPD2EUSB30ADRTR; Mouser Part Number: 595-TPD2EUSB30ADRTR; Mouser Price/Stock: https://www.mouser.co.uk/ProductDetail/Texas-Instruments/TPD2EUSB30ADRTR?qs=O1HRStiETCgOfMa6oTfOlg%3D%3D; Arrow Part Number: TPD2EUSB30ADRTR; Arrow Price/Stock: https://www.arrow.com/en/products/tpd2eusb30adrtr/texas-instruments?utm_currency=USD&region=nac
FB1-FB5 = BLM15PD800SN1D: FERRITE BEAD 80 OHM 0402 1LN; Manufacturer: Murata Electronics; Number of Lines: 1; Current Rating (Max): 1.5A; DC Resistance (DCR) (Max): 70mOhm; Filter Type: Power Line; Packaging: TapeAndReel; Series: EMIFIL®, BLM15; ComponentLink1URL: https://www.murata.com/en-us/products/productdata/8796740059166/ENFA0018.pdf; ComponentLink1Description: Datasheet; ComponentLink2URL: https://www.digikey.com/en/products/detail/murata-electronics/BLM15PD800SN1D/1948308; ComponentLink2Description: DigiKey Link; Part Number: BLM15PD800SN1D; Device Package: 0402 (1005 Metric); Height (Max): 0.022" (0.55mm); Impedance @ Frequency: 80 Ohms @ 100 MHz; LastUpdated: 03.06.2024 19:51:04; Lifecycle Status: Active; Minimum Order: 1; Mounting Type: Surface Mount; Operating Temperature: -55°C ~ 125°C; Package / Case: 0402 (1005 Metric); PartId: 403; Part Status: Active; Price: 0.02; Size / Dimension: 0.039" L x 0.022" W (1.00mm x 0.55mm); Supplier 1: DigiKey; Supplier Part Number 1: 490-5202-1-ND; Value: 80 Ohms @ 100 MHz
IC1 = MAX-F10S-00B: Integrated Circuit; Manufacturer_Name: u-blox; Datasheet Link: https://www.mouser.ph/ProductDetail/u-blox/MAX-F10S-00B?qs=By6Nw2ByBD2CW%252Biwf2Kjow%3D%3D; Height: 2.7mm; Manufacturer_Part_Number: MAX-F10S-00B
IC2 = NEO-M9N-00B: Integrated Circuit; Manufacturer_Name: u-blox; Datasheet Link: https://content.u-blox.com/sites/default/files/NEO-M9N-00B_DataSheet_UBX-19014285.pdf; Height: 2.6mm; Manufacturer_Part_Number: NEO-M9N-00B; Mouser Part Number: 377-NEO-M9N-00B; Mouser Price/Stock: https://www.mouser.co.uk/ProductDetail/u-blox/NEO-M9N-00B?qs=DPoM0jnrROVeJ6BHpcwcjw%3D%3D; Arrow Part Number: NEO-M9N-00B; Arrow Price/Stock: https://www.arrow.com/en/products/neo-m9n-00b/u-blox?utm_currency=USD&region=nac
J1 J2 = RF2-49B-T-00-50-G-HDW: Connector; Manufacturer_Name: Adam Tech; Datasheet Link: https://www.digikey.com/en/products/detail/adam-tech/RF2-49B-T-00-50-G-HDW/9831420?msockid=3e3afa68a50969ca3057ef1ca4c9684b; Height: 10.958mm; Manufacturer_Part_Number: RF2-49B-T-00-50-G-HDW; Arrow Part Number: RF2-49B-T-00-50-G-HDW; Arrow Price/Stock: https://www.arrow.com/en/products/rf2-49b-t-00-50-g-hdw/adam-tech?region=nac
J3 = PBS-5: Connector; Manufacturer: Connfly; Part Number: PBD-5; Part Number1: DS-1023-1x5; System: Connector
J4 = ARJM11B1-805-AB-EW2: Connector; Manufacturer_Name: ABRACON; Datasheet Link: https://abracon.com/Magnetics/ARJM11.pdf; Height: 13.75mm; Manufacturer_Part_Number: ARJM11B1-805-AB-EW2; Mouser Part Number: 815-RJM11B1805ABEW2; Mouser Price/Stock: https://www.mouser.co.uk/ProductDetail/ABRACON/ARJM11B1-805-AB-EW2?qs=YCa%2FAAYMW02bp%252BSCNzjdNA%3D%3D; Arrow Part Number: ARJM11B1-805-AB-EW2; Arrow Price/Stock: https://www.arrow.com/en/products/arjm11b1-805-ab-ew2/abracon?region=nac
J5 = 1054500101: CONN RCP USB3.1 TYPEC 24P SMD RA; Manufacturer: Molex; Connector Type: USB - C (Type - C); Current Rating (Amps): 0.25A, 1A, 5A; Gender: Receptacle; Mating Cycles: 10000; Number of Contacts: 24; Number of Ports: 1; Shielding: Shielded; Specifications: USB 3.1 (USB 3.1 Gen 2, Superspeed+); Voltage - Rated: 30VAC/DC; Part Number: 1054500101; ComponentLink1Description: Datasheet; ComponentLink1URL: https://www.molex.com/pdm_docs/ps/PS-105448-001.pdf; ComponentLink2Description: DigiKey Link; ComponentLink2URL: http://digikey.com/product-detail/en/molex/1054500101/WM12856CT-ND/5843891; LastUpdated: 06.06.2020 2:14:04; Lifecycle Status: Active; Minimum Order: 1; Mounting Feature: Horizontal; Mounting Type: Surface Mount, Right Angle; Through Hole; Operating Temperature: -30°C ~ 85°C; Packaging: TapeAndReel; Part Status: Active; Price: 1.22; Series: 105445; Supplier 1: DigiKey; Supplier Part Number 1: WM12856CT-ND; Termination: Solder
L1 L2 = LQM2HPN3R3MG0L: FIXED IND 3.3UH 1.2A 100 MOHM; Manufacturer: Murata Electronics; Shielding: Shielded; Tolerance: ±20%; DC Resistance (DCR): 125mOhm Max; Frequency - Self Resonant: 30MHz; Inductance Frequency - Test: 1MHz; Material - Core: Ferrite; Type: Multilayer; Inductance: 3.3µH; Packaging: TapeAndReel; Series: LQM2; Height - Seated (Max): 0.039" (1.00mm); Value: 3.3µH; ComponentLink1URL: https://search.murata.co.jp/Ceramy/image/img/P02/JELF243B-0019.pdf; ComponentLink1Description: Datasheet; ComponentLink2URL: http://digikey.com/product-detail/en/murata-electronics/LQM2HPN3R3MG0L/490-5115-1-ND/1893678; ComponentLink2Description: DigiKey Link; Part Number: LQM2HPN3R3MG0L; Current Rating (Amps): 1.2A; Device Package: 1008 (2520 Metric); LastUpdated: 02.09.2020 1:29:06; Lifecycle Status: Active; Minimum Order: 1; Mounting Type: Surface Mount; Operating Temperature: -55°C ~ 125°C; Package / Case: 1008 (2520 Metric); PartId: 3442; Part Status: Active; Price: 0.12; Size / Dimension: 0.098" L x 0.079" W (2.50mm x 2.00mm); Supplier 1: DigiKey; Supplier Part Number 1: 490-5115-1-ND; Supplier Device Package: 1008 (2520 Metric)
MNT1-MNT4 = MOUNT_HOLE: Mount hole
R1 R2 R8 R9 R18 R19 R32-R35 R39 = RC0402FR-074k7L: RES 4.7K OHM 1% 1/16W 0402; Manufacturer: Yageo; Power (Watts): 0.063W, 1/16W; Temperature Coefficient: ±100ppm/°C; Packaging: CutTape; Composition: Thick Film; Tolerance: ±1%; Resistance: 4.7 kOhms; Value: 4.7 kOhms; Series: RC_L; Number of Terminations: 2; ComponentLink1URL: https://www.yageo.com/upload/media/product/productsearch/datasheet/rchip/PYu-RC_Group_51_RoHS_L_10.pdf; ComponentLink1Description: Datasheet; ComponentLink2URL: https://www.digikey.com/en/products/detail/yageo/RC0402FR-074K7L/2827563; ComponentLink2Description: DigiKey Link; Part Number: RC0402FR-074K7L; Device Package: 0402 (1005 Metric); Features: Moisture Resistant; Height - Seated (Max): 0.016" (0.40mm); LastUpdated: 25.07.2024 9:18:11; Lifecycle Status: Active; Minimum Order: 1; Operating Temperature: -55°C ~ 155°C; Package / Case: 0402 (1005 Metric); PartId: 17603; Part Status: Active; Price: 0.01; Size / Dimension: 0.039" L x 0.020" W (1.00mm x 0.50mm); Supplier 1: DigiKey; Supplier Part Number 1: 311-4.7KLRCT-ND; Supplier Device Package: 0402
R3-R6 R16 R37 = RC0402FR-0710KL: RES 10K OHM 1% 1/16W 0402; Manufacturer: Yageo; Power (Watts): 0.063W, 1/16W; Temperature Coefficient: ±100ppm/°C; Packaging: CutTape; Composition: Thick Film; Tolerance: ±1%; Resistance: 10 kOhms; Value: 10 kOhms; Series: RC_L; Number of Terminations: 2; ComponentLink1URL: https://www.yageo.com/upload/media/product/productsearch/datasheet/rchip/PYu-RC_Group_51_RoHS_L_10.pdf; ComponentLink1Description: Datasheet; ComponentLink2URL: https://www.digikey.com/en/products/detail/yageo/RC0402FR-0710KL/726523; ComponentLink2Description: DigiKey Link; Part Number: RC0402FR-0710KL; Device Package: 0402 (1005 Metric); Features: Moisture Resistant; Height - Seated (Max): 0.016" (0.40mm); LastUpdated: 25.07.2024 9:18:11; Lifecycle Status: Active; Minimum Order: 1; Operating Temperature: -55°C ~ 155°C; Package / Case: 0402 (1005 Metric); PartId: 17593; Part Status: Active; Price: 0.01; Size / Dimension: 0.039" L x 0.020" W (1.00mm x 0.50mm); Supplier 1: DigiKey; Supplier Part Number 1: 311-10.0KLRCT-ND; Supplier Device Package: 0402
R7 R11 R23 R26 R27 = RC0402FR-070RL: RES 0 OHM JUMPER 1/16W 0402; Manufacturer: Yageo; Power (Watts): 0.063W, 1/16W; Packaging: CutTape; Composition: Thick Film; Tolerance: Jumper; Resistance: 0 Ohms; Value: 0 Ohms; Series: RC_L; Number of Terminations: 2; ComponentLink1URL: https://www.yageo.com/upload/media/product/productsearch/datasheet/rchip/PYu-RC_Group_51_RoHS_L_10.pdf; ComponentLink1Description: Datasheet; ComponentLink2URL: https://www.digikey.com/en/products/detail/yageo/RC0402FR-070RL/2827570; ComponentLink2Description: DigiKey Link; Part Number: RC0402FR-070RL; Device Package: 0402 (1005 Metric); Features: Moisture Resistant; Height - Seated (Max): 0.016" (0.40mm); LastUpdated: 25.07.2024 9:18:11; Lifecycle Status: Active; Minimum Order: 1; Operating Temperature: -55°C ~ 155°C; Package / Case: 0402 (1005 Metric); PartId: 17630; Part Status: Active; Price: 0.01; Size / Dimension: 0.039" L x 0.020" W (1.00mm x 0.50mm); Supplier 1: DigiKey; Supplier Part Number 1: 311-0.0LRCT-ND; Supplier Device Package: 0402
R10 R12 = RC0402FR-07330RL: RES 330 OHM 1% 1/16W 0402; Manufacturer: Yageo; Power (Watts): 0.063W, 1/16W; Temperature Coefficient: ±100ppm/°C; Packaging: CutTape; Composition: Thick Film; Tolerance: ±1%; Resistance: 330 Ohms; Value: 330 Ohms; Series: RC_L; Number of Terminations: 2; ComponentLink1URL: https://www.yageo.com/upload/media/product/productsearch/datasheet/rchip/PYu-RC_Group_51_RoHS_L_10.pdf; ComponentLink1Description: Datasheet; ComponentLink2URL: https://www.digikey.com/en/products/detail/yageo/RC0402FR-07330RL/726594; ComponentLink2Description: DigiKey Link; Part Number: RC0402FR-07330RL; Device Package: 0402 (1005 Metric); Features: Moisture Resistant; Height - Seated (Max): 0.016" (0.40mm); LastUpdated: 25.07.2024 9:18:08; Lifecycle Status: Active; Minimum Order: 1; Operating Temperature: -55°C ~ 155°C; Package / Case: 0402 (1005 Metric); PartId: 20556; Part Status: Active; Price: 0.01; Size / Dimension: 0.039" L x 0.020" W (1.00mm x 0.50mm); Supplier 1: DigiKey; Supplier Part Number 1: 311-330LRCT-ND; Supplier Device Package: 0402
R13 R30 = RC0402FR-071ML: RES 1M OHM 1% 1/16W 0402; Manufacturer: Yageo; Power (Watts): 0.063W, 1/16W; Temperature Coefficient: ±100ppm/°C; Packaging: CutTape; Composition: Thick Film; Tolerance: ±1%; Resistance: 1 MOhms; Value: 1 MOhms; Series: RC_L; Number of Terminations: 2; ComponentLink1URL: https://www.yageo.com/upload/media/product/productsearch/datasheet/rchip/PYu-RC_Group_51_RoHS_L_10.pdf; ComponentLink1Description: Datasheet; ComponentLink2URL: https://www.digikey.com/en/products/detail/yageo/RC0402FR-071ML/726515; ComponentLink2Description: DigiKey Link; Part Number: RC0402FR-071ML; Device Package: 0402 (1005 Metric); Features: Moisture Resistant; Height - Seated (Max): 0.016" (0.40mm); LastUpdated: 25.07.2024 9:18:11; Lifecycle Status: Active; Minimum Order: 1; Operating Temperature: -55°C ~ 155°C; Package / Case: 0402 (1005 Metric); PartId: 17592; Part Status: Active; Price: 0.01; Size / Dimension: 0.039" L x 0.020" W (1.00mm x 0.50mm); Supplier 1: DigiKey; Supplier Part Number 1: 311-1.00MLRCT-ND; Supplier Device Package: 0402
R14 = RC0402FR-0749K9L: RES 49.9K OHM 1% 1/16W 0402; Manufacturer: Yageo; Power (Watts): 0.063W, 1/16W; Temperature Coefficient: ±100ppm/°C; Packaging: CutTape; Composition: Thick Film; Tolerance: ±1%; Resistance: 49.9 kOhms; Value: 49.9 kOhms; Series: RC_L; Number of Terminations: 2; ComponentLink1URL: https://www.yageo.com/upload/media/product/productsearch/datasheet/rchip/PYu-RC_Group_51_RoHS_L_10.pdf; ComponentLink1Description: Datasheet; ComponentLink2URL: https://www.digikey.com/en/products/detail/yageo/RC0402FR-0749K9L/726620; ComponentLink2Description: DigiKey Link; Part Number: RC0402FR-0749K9L; Device Package: 0402 (1005 Metric); Features: Moisture Resistant; Height - Seated (Max): 0.016" (0.40mm); LastUpdated: 25.07.2024 9:18:11; Lifecycle Status: Active; Minimum Order: 1; Operating Temperature: -55°C ~ 155°C; Package / Case: 0402 (1005 Metric); PartId: 17919; Part Status: Active; Price: 0.01; Size / Dimension: 0.039" L x 0.020" W (1.00mm x 0.50mm); Supplier 1: DigiKey; Supplier Part Number 1: 311-49.9KLRCT-ND; Supplier Device Package: 0402
R15 = RC0402FR-070RL: RES 0 OHM JUMPER 1/16W 0402; Manufacturer: Yageo; Resistance: 0 Ohms; Value: 0 Ohms; Power (Watts): 0.063W, 1/16W; Packaging: CutTape; Composition: Thick Film; Tolerance: Jumper; Series: RC_L; Number of Terminations: 2; ComponentLink1URL: https://www.yageo.com/upload/media/product/productsearch/datasheet/rchip/PYu-RC_Group_51_RoHS_L_10.pdf; ComponentLink1Description: Datasheet; ComponentLink2URL: https://www.digikey.com/en/products/detail/yageo/RC0402FR-070RL/2827570; ComponentLink2Description: DigiKey Link; Part Number: RC0402FR-070RL; Device Package: 0402 (1005 Metric); Features: Moisture Resistant; Height - Seated (Max): 0.016" (0.40mm); LastUpdated: 25.07.2024 9:18:11; Lifecycle Status: Active; Minimum Order: 1; Operating Temperature: -55°C ~ 155°C; Package / Case: 0402 (1005 Metric); PartId: 17630; Part Status: Active; Price: 0.01; Size / Dimension: 0.039" L x 0.020" W (1.00mm x 0.50mm); Supplier 1: DigiKey; Supplier Part Number 1: 311-0.0LRCT-ND; Supplier Device Package: 0402
R17 = RC0402FR-07100KL: RES 100K OHM 1% 1/16W 0402; Manufacturer: Yageo; Power (Watts): 0.063W, 1/16W; Temperature Coefficient: ±100ppm/°C; Packaging: CutTape; Composition: Thick Film; Tolerance: ±1%; Resistance: 100 kOhms; Value: 100 kOhms; Series: RC_L; Number of Terminations: 2; ComponentLink1URL: https://www.yageo.com/upload/media/product/productsearch/datasheet/rchip/PYu-RC_Group_51_RoHS_L_10.pdf; ComponentLink1Description: Datasheet; ComponentLink2URL: https://www.digikey.com/en/products/detail/yageo/RC0402FR-07100KL/726526; ComponentLink2Description: DigiKey Link; Part Number: RC0402FR-07100KL; Device Package: 0402 (1005 Metric); Features: Moisture Resistant; Height - Seated (Max): 0.016" (0.40mm); LastUpdated: 25.07.2024 9:18:11; Lifecycle Status: Active; Minimum Order: 1; Operating Temperature: -55°C ~ 155°C; Package / Case: 0402 (1005 Metric); PartId: 17595; Part Status: Active; Price: 0.01; Size / Dimension: 0.039" L x 0.020" W (1.00mm x 0.50mm); Supplier 1: DigiKey; Supplier Part Number 1: 311-100KLRCT-ND; Supplier Device Package: 0402
R20 = RC0402FR-0733RL: RES 33 OHM 1% 1/16W 0402; Manufacturer: Yageo; Power (Watts): 0.063W, 1/16W; Temperature Coefficient: ±100ppm/°C; Packaging: CutTape; Composition: Thick Film; Tolerance: ±1%; Resistance: 33 Ohms; Value: 33 Ohms; Series: RC_L; Number of Terminations: 2; ComponentLink1URL: https://www.yageo.com/upload/media/product/productsearch/datasheet/rchip/PYu-RC_Group_51_RoHS_L_10.pdf; ComponentLink1Description: Datasheet; ComponentLink2URL: https://www.digikey.com/en/products/detail/yageo/RC0402FR-0733RL/726593; ComponentLink2Description: DigiKey Link; Part Number: RC0402FR-0733RL; Device Package: 0402 (1005 Metric); Features: Moisture Resistant; Height - Seated (Max): 0.016" (0.40mm); LastUpdated: 25.07.2024 9:18:08; Lifecycle Status: Active; Minimum Order: 1; Operating Temperature: -55°C ~ 155°C; Package / Case: 0402 (1005 Metric); PartId: 20555; Part Status: Active; Price: 0.01; Size / Dimension: 0.039" L x 0.020" W (1.00mm x 0.50mm); Supplier 1: DigiKey; Supplier Part Number 1: 311-33.0LRCT-ND; Supplier Device Package: 0402
R21 = RC0402FR-0724KL: RES 24K OHM 1% 1/16W 0402; Manufacturer: Yageo; Power (Watts): 0.063W, 1/16W; Temperature Coefficient: ±100ppm/°C; Packaging: CutTape; Composition: Thick Film; Tolerance: ±1%; Resistance: 24 kOhms; Value: 24 kOhms; Series: RC_L; Number of Terminations: 2; ComponentLink1URL: https://www.yageo.com/upload/media/product/productsearch/datasheet/rchip/PYu-RC_Group_51_RoHS_L_10.pdf; ComponentLink1Description: Datasheet; ComponentLink2URL: https://www.digikey.com/en/products/detail/yageo/RC0402FR-0724KL/2827581; ComponentLink2Description: DigiKey Link; Part Number: RC0402FR-0724KL; Device Package: 0402 (1005 Metric); Features: Moisture Resistant; Height - Seated (Max): 0.016" (0.40mm); LastUpdated: 25.07.2024 9:18:19; Lifecycle Status: Active; Minimum Order: 1; Operating Temperature: -55°C ~ 155°C; Package / Case: 0402 (1005 Metric); PartId: 2562; Part Status: Active; Price: 0.01; Size / Dimension: 0.039" L x 0.020" W (1.00mm x 0.50mm); Supplier 1: DigiKey; Supplier Part Number 1: 311-24KLRCT-ND; Supplier Device Package: 0402
R22 R24 R25 = RC0402FR-0747KL: RES 47K OHM 1% 1/16W 0402; Manufacturer: Yageo; Power (Watts): 0.063W, 1/16W; Temperature Coefficient: ±100ppm/°C; Packaging: CutTape; Composition: Thick Film; Tolerance: ±1%; Resistance: 47 kOhms; Value: 47 kOhms; Series: RC_L; Number of Terminations: 2; ComponentLink1URL: https://www.yageo.com/upload/media/product/productsearch/datasheet/rchip/PYu-RC_Group_51_RoHS_L_10.pdf; ComponentLink1Description: Datasheet; ComponentLink2URL: https://www.digikey.com/en/products/detail/yageo/RC0402FR-0747KL/726616; ComponentLink2Description: DigiKey Link; Part Number: RC0402FR-0747KL; Device Package: 0402 (1005 Metric); Features: Moisture Resistant; Height - Seated (Max): 0.016" (0.40mm); LastUpdated: 25.07.2024 9:18:08; Lifecycle Status: Active; Minimum Order: 1; Operating Temperature: -55°C ~ 155°C; Package / Case: 0402 (1005 Metric); PartId: 20550; Part Status: Active; Price: 0.01; Size / Dimension: 0.039" L x 0.020" W (1.00mm x 0.50mm); Supplier 1: DigiKey; Supplier Part Number 1: 311-47.0KLRCT-ND; Supplier Device Package: 0402
R28 = RC0402FR-07200RL: RES 200 OHM 1% 1/16W 0402; Manufacturer: Yageo; Temperature Coefficient: ±100ppm/°C; Power (Watts): 0.063W, 1/16W; Part Number: RC0402FR-07200RL; Value: 200 Ohms; Tolerance: ±1%; Packaging: CutTape; Series: RC_L; ComponentLink1URL: https://www.yageo.com/upload/media/product/productsearch/datasheet/rchip/PYu-RC_Group_51_RoHS_L_10.pdf; ComponentLink1Description: Datasheet; ComponentLink2URL: https://www.digikey.com/en/products/detail/yageo/RC0402FR-07200RL/2827569; ComponentLink2Description: DigiKey Link; Composition: Thick Film; Device Package: 0402 (1005 Metric); Features: Moisture Resistant; Height - Seated (Max): 0.016" (0.40mm); LastUpdated: 25.07.2024 9:18:11; Lifecycle Status: Active; Minimum Order: 1; Number of Terminations: 2; Operating Temperature: -55°C ~ 155°C; Package / Case: 0402 (1005 Metric); PartId: 17915; Part Status: Active; Price: 0.01; Resistance: 200 Ohms; Size / Dimension: 0.039" L x 0.020" W (1.00mm x 0.50mm); Supplier 1: DigiKey; Supplier Part Number 1: 311-200LRCT-ND; Supplier Device Package: 0402
R29 R31 = RC0402FR-075k1L: RES 5.1K OHM 1% 1/16W 0402; Manufacturer: Yageo; Power (Watts): 0.063W, 1/16W; Temperature Coefficient: ±100ppm/°C; Packaging: CutTape; Composition: Thick Film; Tolerance: ±1%; Resistance: 5.1 kOhms; Value: 5.1 kOhms; Series: RC_L; Number of Terminations: 2; ComponentLink1URL: https://www.yageo.com/upload/media/product/productsearch/datasheet/rchip/PYu-RC_Group_51_RoHS_L_10.pdf; ComponentLink1Description: Datasheet; ComponentLink2URL: https://www.digikey.com/en/products/detail/yageo/RC0402FR-075K1L/726624; ComponentLink2Description: DigiKey Link; Part Number: RC0402FR-075K1L; Device Package: 0402 (1005 Metric); Features: Moisture Resistant; Height - Seated (Max): 0.016" (0.40mm); LastUpdated: 25.07.2024 9:18:11; Lifecycle Status: Active; Minimum Order: 1; Operating Temperature: -55°C ~ 155°C; Package / Case: 0402 (1005 Metric); PartId: 17937; Part Status: Active; Price: 0.01; Size / Dimension: 0.039" L x 0.020" W (1.00mm x 0.50mm); Supplier 1: DigiKey; Supplier Part Number 1: 311-5.10KLRCT-ND; Supplier Device Package: 0402
R36 = RC0402FR-0722RL: RES 22 OHM 1% 1/16W 0402; Manufacturer: Yageo; Power (Watts): 0.063W, 1/16W; Temperature Coefficient: ±100ppm/°C; Packaging: CutTape; Composition: Thick Film; Tolerance: ±1%; Resistance: 22 Ohms; Value: 22 Ohms; Series: RC_L; Number of Terminations: 2; ComponentLink1URL: https://www.yageo.com/upload/media/product/productsearch/datasheet/rchip/PYu-RC_Group_51_RoHS_L_10.pdf; ComponentLink1Description: Datasheet; ComponentLink2URL: https://www.digikey.com/en/products/detail/yageo/RC0402FR-0722RL/726562; ComponentLink2Description: DigiKey Link; Part Number: RC0402FR-0722RL; Device Package: 0402 (1005 Metric); Features: Moisture Resistant; Height - Seated (Max): 0.016" (0.40mm); LastUpdated: 25.07.2024 9:18:11; Lifecycle Status: Active; Minimum Order: 1; Operating Temperature: -55°C ~ 155°C; Package / Case: 0402 (1005 Metric); PartId: 17600; Part Status: Active; Price: 0.01; Size / Dimension: 0.039" L x 0.020" W (1.00mm x 0.50mm); Supplier 1: DigiKey; Supplier Part Number 1: 311-22.0LRCT-ND; Supplier Device Package: 0402
R38 = RC0402FR-0739K2L: RES 39.2K OHM 1% 1/16W 0402; Manufacturer: Yageo; Power (Watts): 0.063W, 1/16W; Temperature Coefficient: ±100ppm/°C; Packaging: CutTape; Composition: Thick Film; Tolerance: ±1%; Resistance: 39.2 kOhms; Value: 39.2 kOhms; Series: RC_L; Number of Terminations: 2; ComponentLink1URL: https://www.yageo.com/upload/media/product/productsearch/datasheet/rchip/PYu-RC_Group_51_RoHS_L_10.pdf; ComponentLink1Description: Datasheet; ComponentLink2URL: https://www.digikey.com/en/products/detail/yageo/RC0402FR-0739K2L/726603; ComponentLink2Description: DigiKey Link; Part Number: RC0402FR-0739K2L; Device Package: 0402 (1005 Metric); Features: Moisture Resistant; Height - Seated (Max): 0.016" (0.40mm); LastUpdated: 25.07.2024 9:18:08; Lifecycle Status: Active; Minimum Order: 1; Operating Temperature: -55°C ~ 155°C; Package / Case: 0402 (1005 Metric); PartId: 20819; Part Status: Active; Price: 0.01; Size / Dimension: 0.039" L x 0.020" W (1.00mm x 0.50mm); Supplier 1: DigiKey; Supplier Part Number 1: 311-39.2KLRCT-ND; Supplier Device Package: 0402
SW1 = 218-4LPST: SWITCH SLIDE DIP SPST 25MA 24V; Manufacturer: CTS Electrocomponents; Actuator Level: Flush, Recessed; Actuator Type: Slide (Standard); Number of Positions: 4; Pitch: 0.050" (1.27mm), Half; Voltage Rating: 24VDC; Washable: Yes; Part Number: 218-4LPST; Circuit: SPST; ComponentLink1Description: Datasheet; ComponentLink1URL: https://www.ctscorp.com/wp-content/uploads/218.pdf; ComponentLink2Description: DigiKey Link; ComponentLink2URL: http://digikey.com/product-detail/en/cts-electrocomponents/218-4LPST/CT2184LPST-ND/267320; Contact Finish: Gold; Contact Material: Beryllium Copper; Current Rating (Amps): 25mA; Features: Epoxy Sealed Terminals, Tape Seal; Height Above Board: 0.104" (2.65mm); LastUpdated: 1/4/2020 7:03:56 PM; Lifecycle Status: Active; Minimum Order: 1; Mounting Type: Surface Mount; Operating Temperature: -55°C ~ 85°C; Packaging: Tube; PartId: 10; Part Status: Active; Price: 1.18; Series: 218; Supplier 1: DigiKey; Supplier Part Number 1: CT2184LPST-ND; Termination Style: Gull Wing
TP1 TP2 = PAD_TEST: Test Point; Manufacturer: {Manufacturer}; Reseller3: {Reseller3}; Reseller1: {Reseller1}; Tempcoeff: {Tempcoeff}; Reseller2: {Reseller2}; Tolerance: {Tolerance}; Value: .NetName; PowerVoltage: {PowerVoltage}; CatalogueCode: {CatalogueCode}; Case: {Case}
U1 U4 = NC7WZ125K8X: Integrated Circuit; Manufacturer_Name: onsemi; Datasheet Link: https://www.lcsc.com/datasheet/lcsc_datasheet_2410121813_onsemi-NC7WZ125K8X_C457629.pdf; Height: 0.9mm; Manufacturer_Part_Number: NC7WZ125K8X
U2 U3 U5 U6 = SN74LVC1G3157DBVR: Integrated Circuit; Manufacturer_Name: Texas Instruments; Datasheet Link: http://componentsearchengine.com/Datasheets/1/SN74LVC1G3157DBVR.pdf; Height: 1.45mm; Manufacturer_Part_Number: SN74LVC1G3157DBVR; Mouser Part Number: 595-SN74LVC1G3157DBV; Mouser Price/Stock: https://www.mouser.co.uk/ProductDetail/Texas-Instruments/SN74LVC1G3157DBVR?qs=PVVDbbWpW3ID6l2sElWeMw%3D%3D; Arrow Part Number: SN74LVC1G3157DBVR; Arrow Price/Stock: https://www.arrow.com/en/products/sn74lvc1g3157dbvr/texas-instruments?region=nac
U7 = IC_AX88279
U9 = CMP-0240-00158-1: Synchronous rectification with inhibit, 1.5 A, 1.5 MHz adjustable, step-down switching regulator, 6-Pin DFN; Manufacturer: STMicroelectronics; Min Input Voltage: 2.7V; Number of Outputs: 1; Output Current: 1.5A; Output Voltage: 3.3V; Max Supply Voltage: 6V; Switching Frequency: 1.5MHz; Output Type: Fixed,Adjustable; Quiescent Current: 1.5mA; Efficiency: 90%; Synchronous Rectifier: Yes; Polarity: Positive; Accuracy: 2%; PackageDescription: 6-Pin Plastic, Dual LLP, 3 x 3 mm Body, 0.95 mm Pitch, Exposed Pad; ComponentLink1URL: http://www.st.com; DatasheetVersion: May-2009; ComponentLink2Description: Datasheet; ComponentLink2URL: http://www.st.com/internet/com/TECHNICAL_RESOURCES/TECHNICAL_LITERATURE/DATASHEET/CD00100211.pdf; PackageVersion: 2008; PackageReference: DFN6D; ComponentLink1Description: Manufacturer URL; Supplier: Digikey; Supplier Part Number: 497-6311-1-ND; Manufacturer Part Number: ST1S06PU33R; RoHS: Yes; Category: Voltage Regulators - Switching; Stock: 5274; Pricing: 1=1.46, 10=1.306, 25=1.2392, 100=1.0179, 250=0.95156, 500=0.8409, 1000=0.66387 (USD); Mounting Technology: Surface Mount; Case/Package: DFN; Pins: 6; Weight: 0.000744oz; Min Operating Temperature: -30°C; Max Operating Temperature: 125°C; Packaging: Tape and Reel; Max Output current: 1.5A; Series: -; Package Quantity: 1; Operating Supply Voltage: 6V; Frequency: 1.5MHz; Length: 3.1mm; Width: 3.1mm; Height: 0.95mm; Radiation Hardening: No; Lead Free: Lead Free; RoHS Compliant: Yes; ComponentLink3URL: https://datasheet.ciiva.com/15113/getdatasheetpartid-188384-15113793.pdf?src-supplier=Verical; ComponentLink3Description: https://datasheet.ciiva.com/15113/getdatasheetpartid-188384-15113793.pdf?src-supplier=Verical; ComponentLink4URL: https://datasheet.ciiva.com/2029/cd00100211-2029328.pdf?src-supplier=Digikey; ComponentLink4Description: https://datasheet.ciiva.com/2029/cd00100211-2029328.pdf?src-supplier=Digikey; ComponentLink5URL: https://datasheet.ciiva.com/2029/cd00100211-2029329.pdf?src-supplier=Digikey; ComponentLink5Description: https://datasheet.ciiva.com/2029/cd00100211-2029329.pdf?src-supplier=Digikey; ComponentLink6URL: https://datasheet.ciiva.com/2029/cd00100211-2029330.pdf?src-supplier=Digikey; ComponentLink6Description: https://datasheet.ciiva.com/2029/cd00100211-2029330.pdf?src-supplier=Digikey; ComponentLink7URL: https://datasheet.ciiva.com/16489/cd00100211-16489901.pdf?src-supplier=Future+Electronics; ComponentLink7Description: https://datasheet.ciiva.com/16489/cd00100211-16489901.pdf?src-supplier=Future+Electronics; ComponentLink8URL: https://datasheet.ciiva.com/4905/cd00100211-4905371.pdf?src-supplier=Mouser; ComponentLink8Description: https://datasheet.ciiva.com/4905/cd00100211-4905371.pdf?src-supplier=Mouser
U10 = CMP-00252-18686437-1: SST25VF016B-50-4I-QAF-T Flash Serial-SPI 3.3V 16Mbit 2M x 8bit 8ns 8-Pin WSON EP T/R - Tape and Reel; Max Supply Voltage: 3.6V; Density: 16Mb; Interface: SPI; Memory Size: 2MB; Data Bus Width: 8b; Max Frequency: 50MHz; Nominal Supply Current: 15mA; Address Bus Width: 1b; Min Supply Voltage: 2.7V; Sync/Async: Synchronous; Packaging: Tape and Reel; Operating Supply Voltage: 3.3V; Access Time: 8ns; Lead Free: Lead Free; Height: 800µm; RoHS: Compliant; Max Operating Temperature: 85°C; Lifecycle Status: Production; NexarPartId: 18686437; Frequency: 50MHz; Schedule B: 8542320050, 8542320050; Min Operating Temperature: -40°C; Word Size: 8b; Memory Type: FLASH; Number of Pins: 8; Radiation Hardening: No; Mount: Surface Mount
U11 = CMP-0240-00159-1: Synchronous rectification with inhibit, 1.5 A, 1.5 MHz adjustable, step-down switching regulator, 6-Pin DFN; PackageDescription: 6-Pin Plastic, Dual LLP, 3 x 3 mm Body, 0.95 mm Pitch, Exposed Pad; ComponentLink2URL: http://www.st.com/internet/com/TECHNICAL_RESOURCES/TECHNICAL_LITERATURE/DATASHEET/CD00100211.pdf; ComponentLink1Description: Manufacturer URL; DatasheetVersion: May-2009; ComponentLink1URL: http://www.st.com; ComponentLink2Description: Datasheet; PackageVersion: 2008; PackageReference: DFN6D
Y1 = NX3225GA-25.000M-STD-CRG-2: CRYSTAL 25.0000MHZ 8PF SMD; Manufacturer: NDK America, Inc.; Frequency Stability: ±30ppm; Frequency Tolerance: ±20ppm; ESR (Equivalent Series Resistance): 50 Ohms; Operating Mode: Fundamental; Load Capacitance: 8pF; Packaging: TapeAndReel; Frequency: 25 MHz; Series: NX3225GA; ComponentLink1URL: http://www.ndk.com/images/products/catalog/c_NX3225GA-STD-CRG-2_e.pdf; ComponentLink1Description: Datasheet; ComponentLink2URL: https://www.digikey.com/en/products/detail/ndk-america-inc/NX3225GA-25-000M-STD-CRG-2/5022963; ComponentLink2Description: DigiKey Link; Part Number: NX3225GA-25.000M-STD-CRG-2; Height - Seated (Max): 0.035" (0.90mm); LastUpdated: 03.06.2024 20:02:19; Lifecycle Status: Active; Minimum Order: 1; Mounting Type: Surface Mount; Operating Temperature: -40°C ~ 85°C; Package / Case: 4-SMD, No Lead; PartId: 547; Part Status: Active; Price: 0.27; Size / Dimension: 0.126" L x 0.098" W (3.20mm x 2.50mm); Supplier 1: DigiKey; Supplier Part Number 1: 644-1259-1-ND; Type: MHz Crystal; Value: 25 MHz

## Assembly variants
release: not fitted R7 R11 R15